# EAGLE design M-Enc-C (EAGLE 7.6.0)

## Sheet 1 of 2
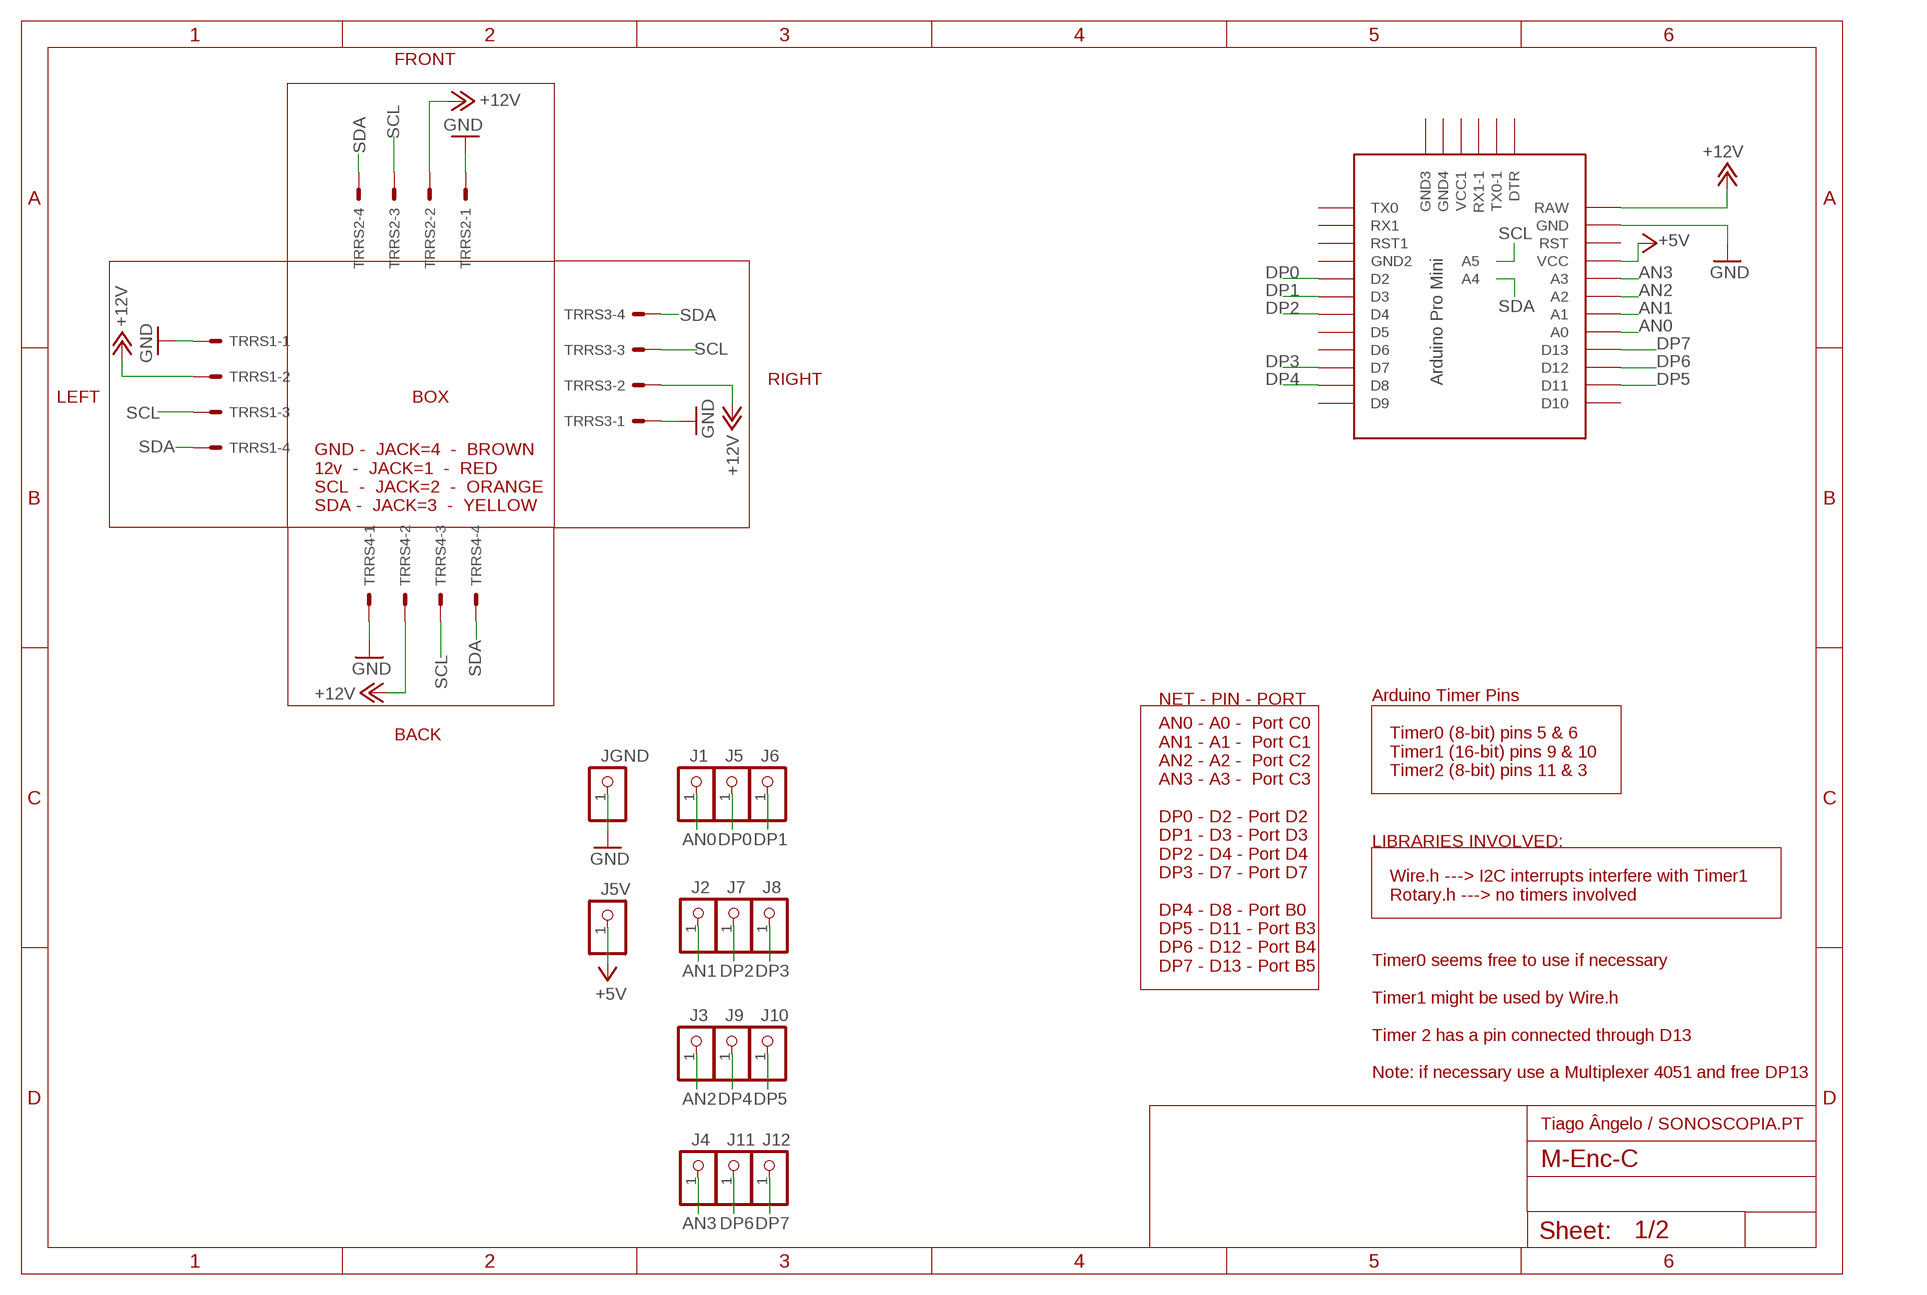
[diagram p0: schematic, sheet 1]

### Parts
J1  PINHD-1X1  [1X01]
J2  PINHD-1X1  [1X01]
J3  PINHD-1X1  [1X01]
J4  PINHD-1X1  [1X01]
J5  PINHD-1X1  [1X01]
J5V  PINHD-1X1  [1X01]
J6  PINHD-1X1  [1X01]
J7  PINHD-1X1  [1X01]
J8  PINHD-1X1  [1X01]
J9  PINHD-1X1  [1X01]
J10  PINHD-1X1  [1X01]
J11  PINHD-1X1  [1X01]
J12  PINHD-1X1  [1X01]
JGND  PINHD-1X1  [1X01]
TRRS1  22-27-2041-04  [6410-04]
TRRS2  22-27-2041-04  [6410-04]
TRRS3  22-27-2041-04  [6410-04]
TRRS4  22-27-2041-04  [6410-04]
U$1  PRO-MINI-2  [PRO-MINI-2]

### Nets
+5V: J5V.1 U$1.VCC
+12V: TRRS1.2 TRRS2.2 TRRS3.2 TRRS4.2 U$1.RAW
AN0: J1.1 U$1.A0
AN1: J2.1 U$1.A1
AN2: J3.1 U$1.A2
AN3: J4.1 U$1.A3
DP0: J5.1 U$1.D2
DP1: J6.1 U$1.D3
DP2: J7.1 U$1.D4
DP3: J8.1 U$1.D7
DP4: J9.1 U$1.D8
DP5: J10.1 U$1.D11
DP6: J11.1 U$1.D12
DP7: J12.1 U$1.D13
GND: JGND.1 TRRS1.1 TRRS2.1 TRRS3.1 TRRS4.1 U$1.GND
SCL: TRRS1.3 TRRS2.3 TRRS3.3 TRRS4.3 U$1.A5
SDA: TRRS1.4 TRRS2.4 TRRS3.4 TRRS4.4 U$1.A4
Unconnected: U$1.D5 U$1.D6 U$1.D9 U$1.D10 U$1.DTR U$1.GND1(GND2) U$1.GND2(GND3) U$1.GND3(GND4) U$1.RST U$1.RST1 U$1.RX1 U$1.RX1-1 U$1.TX0 U$1.TX0-1 U$1.VCC1

### Notes on the sheet
- FRONT
- RIGHT
- LEFT | BOX
- GND -  JACK=4  -  BROWN
  12v  -  JACK=1  -  RED
  SCL  -  JACK=2  -  ORANGE
  SDA -  JACK=3  -  YELLOW
- NET - PIN - PORT | Arduino Timer Pins
- BACK
- Timer0 (8-bit) pins 5 & 6
  Timer1 (16-bit) pins 9 & 10 
  Timer2 (8-bit) pins 11 & 3
- LIBRARIES INVOLVED:
- Wire.h ---> I2C interrupts interfere with Timer1
  Rotary.h ---> no timers involved
- AN0 - A0 -  Port C0
  AN1 - A1 -  Port C1
  AN2 - A2 -  Port C2
  AN3 - A3 -  Port C3 
  
  DP0 - D2 - Port D2
  DP1 - D3 - Port D3
  DP2 - D4 - Port D4
  DP3 - D7 - Port D7
  
  DP4 - D8 - Port B0
  DP5 - D11 - Port B3
  DP6 - D12 - Port B4
  DP7 - D13 - Port B5
- Timer0 seems free to use if necessary 
  
  Timer1 might be used by Wire.h
  
  Timer 2 has a pin connected through D13
  
  Note: if necessary use a Multiplexer 4051 and free DP13
- Tiago Ângelo / SONOSCOPIA.PT

## Sheet 2 of 2
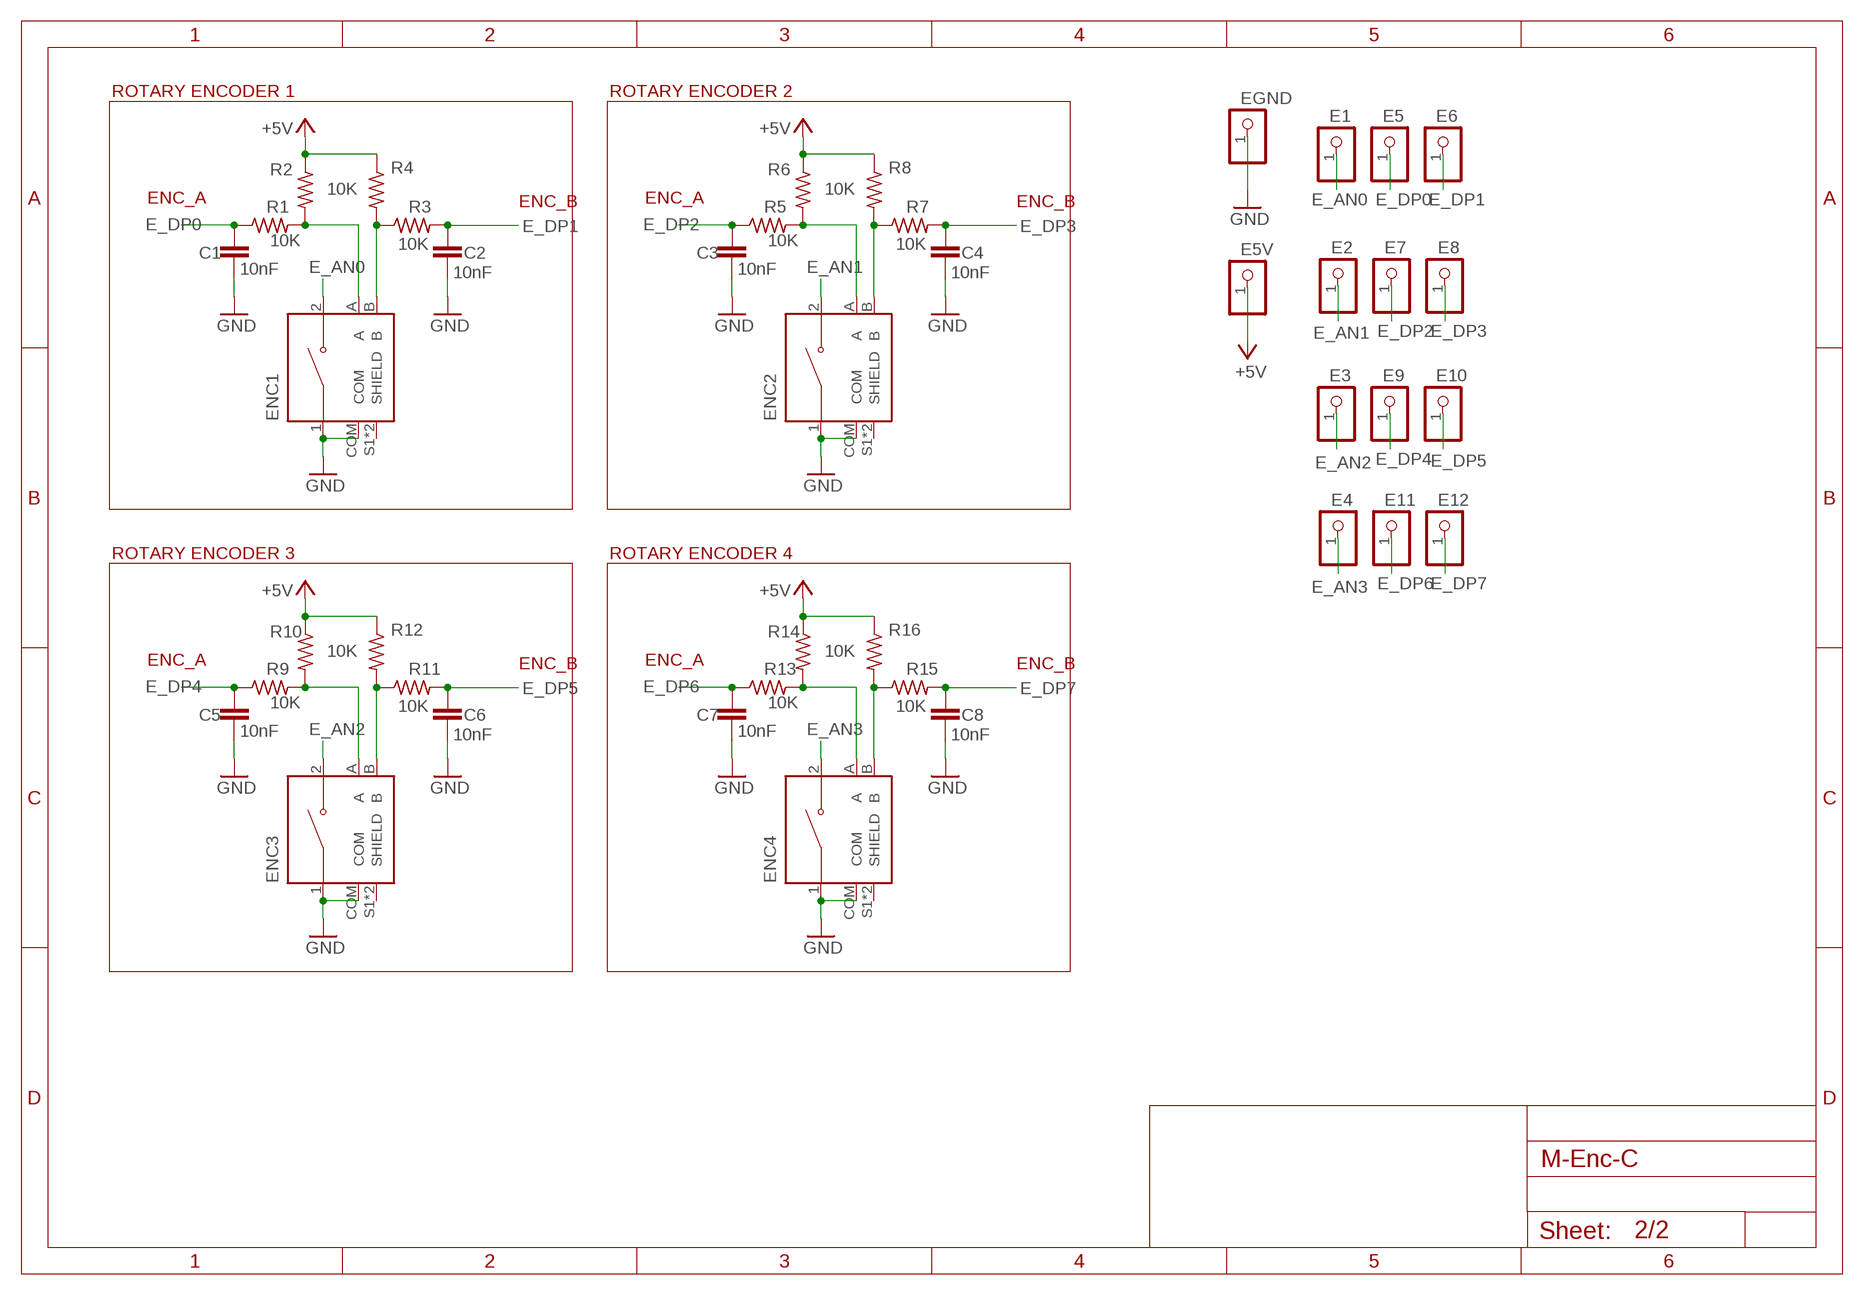
[diagram p1: schematic, sheet 2]

### Parts
C1  10nF  C5/2.5  [C5B2.5]
C2  10nF  C10/4  [C10B4]
C3  10nF  C5/2.5  [C5B2.5]
C4  10nF  C10/4  [C10B4]
C5  10nF  C10/4  [C10B4]
C6  10nF  C2.5/2  [C2.5-2]
C7  10nF  C10/4  [C10B4]
C8  10nF  C2.5/2  [C2.5-2]
E1  PINHD-1X1  [1X01]
E2  PINHD-1X1  [1X01]
E3  PINHD-1X1  [1X01]
E4  PINHD-1X1  [1X01]
E5  PINHD-1X1  [1X01]
E5V  PINHD-1X1  [1X01]
E6  PINHD-1X1  [1X01]
E7  PINHD-1X1  [1X01]
E8  PINHD-1X1  [1X01]
E9  PINHD-1X1  [1X01]
E10  PINHD-1X1  [1X01]
E11  PINHD-1X1  [1X01]
E12  PINHD-1X1  [1X01]
EGND  PINHD-1X1  [1X01]
ENC1  PEC11R-4215F-S0024  [XDCR_PEC11R-4215F-S0024]
ENC2  PEC11R-4215F-S0024  [XDCR_PEC11R-4215F-S0024]
ENC3  PEC11R-4215F-S0024  [XDCR_PEC11R-4215F-S0024]
ENC4  PEC11R-4215F-S0024  [XDCR_PEC11R-4215F-S0024]
R1  10K  R-US_0204/7  [0204/7]
R2  10K  R-US_0204/7  [0204/7]
R3  10K  R-US_0204/7  [0204/7]
R4  10K  R-US_0207/12  [0207/12]
R5  10K  R-US_0204/7  [0204/7]
R6  10K  R-US_0204/7  [0204/7]
R7  10K  R-US_0204/7  [0204/7]
R8  10K  R-US_0207/12  [0207/12]
R9  10K  R-US_0204/7  [0204/7]
R10  10K  R-US_0207/12  [0207/12]
R11  10K  R-US_0204/7  [0204/7]
R12  10K  R-US_0204/7  [0204/7]
R13  10K  R-US_0204/7  [0204/7]
R14  10K  R-US_0207/12  [0207/12]
R15  10K  R-US_0204/7  [0204/7]
R16  10K  R-US_0204/7  [0204/7]

### Nets
E_+5V: E5V.1 R2.1 R4.1 R6.1 R8.1 R10.1 R12.1 R14.1 R16.1 ; supply symbol labelled +5V
E_AN0: E1.1 ENC1.2
E_AN1: E2.1 ENC2.2
E_AN2: E3.1 ENC3.2
E_AN3: E4.1 ENC4.2
E_DP0: C1.1 E5.1 R1.1
E_DP1: C2.1 E6.1 R3.2
E_DP2: C3.1 E7.1 R5.1
E_DP3: C4.1 E8.1 R7.2
E_DP4: C5.1 E9.1 R9.1
E_DP5: C6.1 E10.1 R11.2
E_DP6: C7.1 E11.1 R13.1
E_DP7: C8.1 E12.1 R15.2
E_GND: C1.2 C2.2 C3.2 C4.2 C5.2 C6.2 C7.2 C8.2 EGND.1 ENC1.1 ENC1.COM ENC2.1 ENC2.COM ENC3.1 ENC3.COM ENC4.1 ENC4.COM ; supply symbol labelled GND
N$1: ENC2.A R5.2 R6.2
N$2: ENC1.B R3.1 R4.2
N$3: ENC2.B R7.1 R8.2
N$4: ENC3.A R9.2 R10.2
N$5: ENC3.B R11.1 R12.2
N$6: ENC4.A R13.2 R14.2
N$7: ENC4.B R15.1 R16.2
N$9: ENC1.A R1.2 R2.2
Unconnected: ENC1.S1(SHIELD) ENC1.S2(SHIELD) ENC2.S1(SHIELD) ENC2.S2(SHIELD) ENC3.S1(SHIELD) ENC3.S2(SHIELD) ENC4.S1(SHIELD) ENC4.S2(SHIELD)

### Notes on the sheet
- ROTARY ENCODER 1 | ROTARY ENCODER 2
- ENC_A | ENC_B | ENC_A | ENC_B
- ROTARY ENCODER 3 | ROTARY ENCODER 4
- ENC_A | ENC_B | ENC_A | ENC_B

## Library data of the parts
C1-C8 = capacitor-wima:C: CAPACITOR naming: grid - package width
E1-E5 E5V E6-E12 EGND J1-J5 J5V J6-J12 JGND = adafruit:PINHD-1X1: Pin header 1x1 for 0.1" spacing With round pins
ENC1-ENC4 = PEC11R-4215F-S0024:PEC11R-4215F-S0024: Incremental Encoder, 12 Mm, Contact Rating 10 Ma - 5 Vdc Check prices <https://pricing.snapeda.com/parts/PEC11R-4215F-S0024/Bourns/view-part?ref=eda>; AVAILABILITY: Warning; DESCRIPTION: Rotary Encoder Mechanical 24 Quadrature (Incremental) Vertical; MF: Bourns; MP: PEC11R-4215F-S0024; PACKAGE: None; PRICE: None; PURCHASE-URL: https://pricing.snapeda.com/search/part/PEC11R-4215F-S0024/?ref=eda
R1-R16 = resistor:R-US_: RESISTOR, American symbol
TRRS1-TRRS4 = _M-BLOCKS:22-?-04: CONNECTOR wire to board 2.54 mm (.1 inch) pitch header
U$1 = _M-BLOCKS:PRO-MINI-2: Arduino Pro Mini Layout 2 Sparkfun.com

## Board
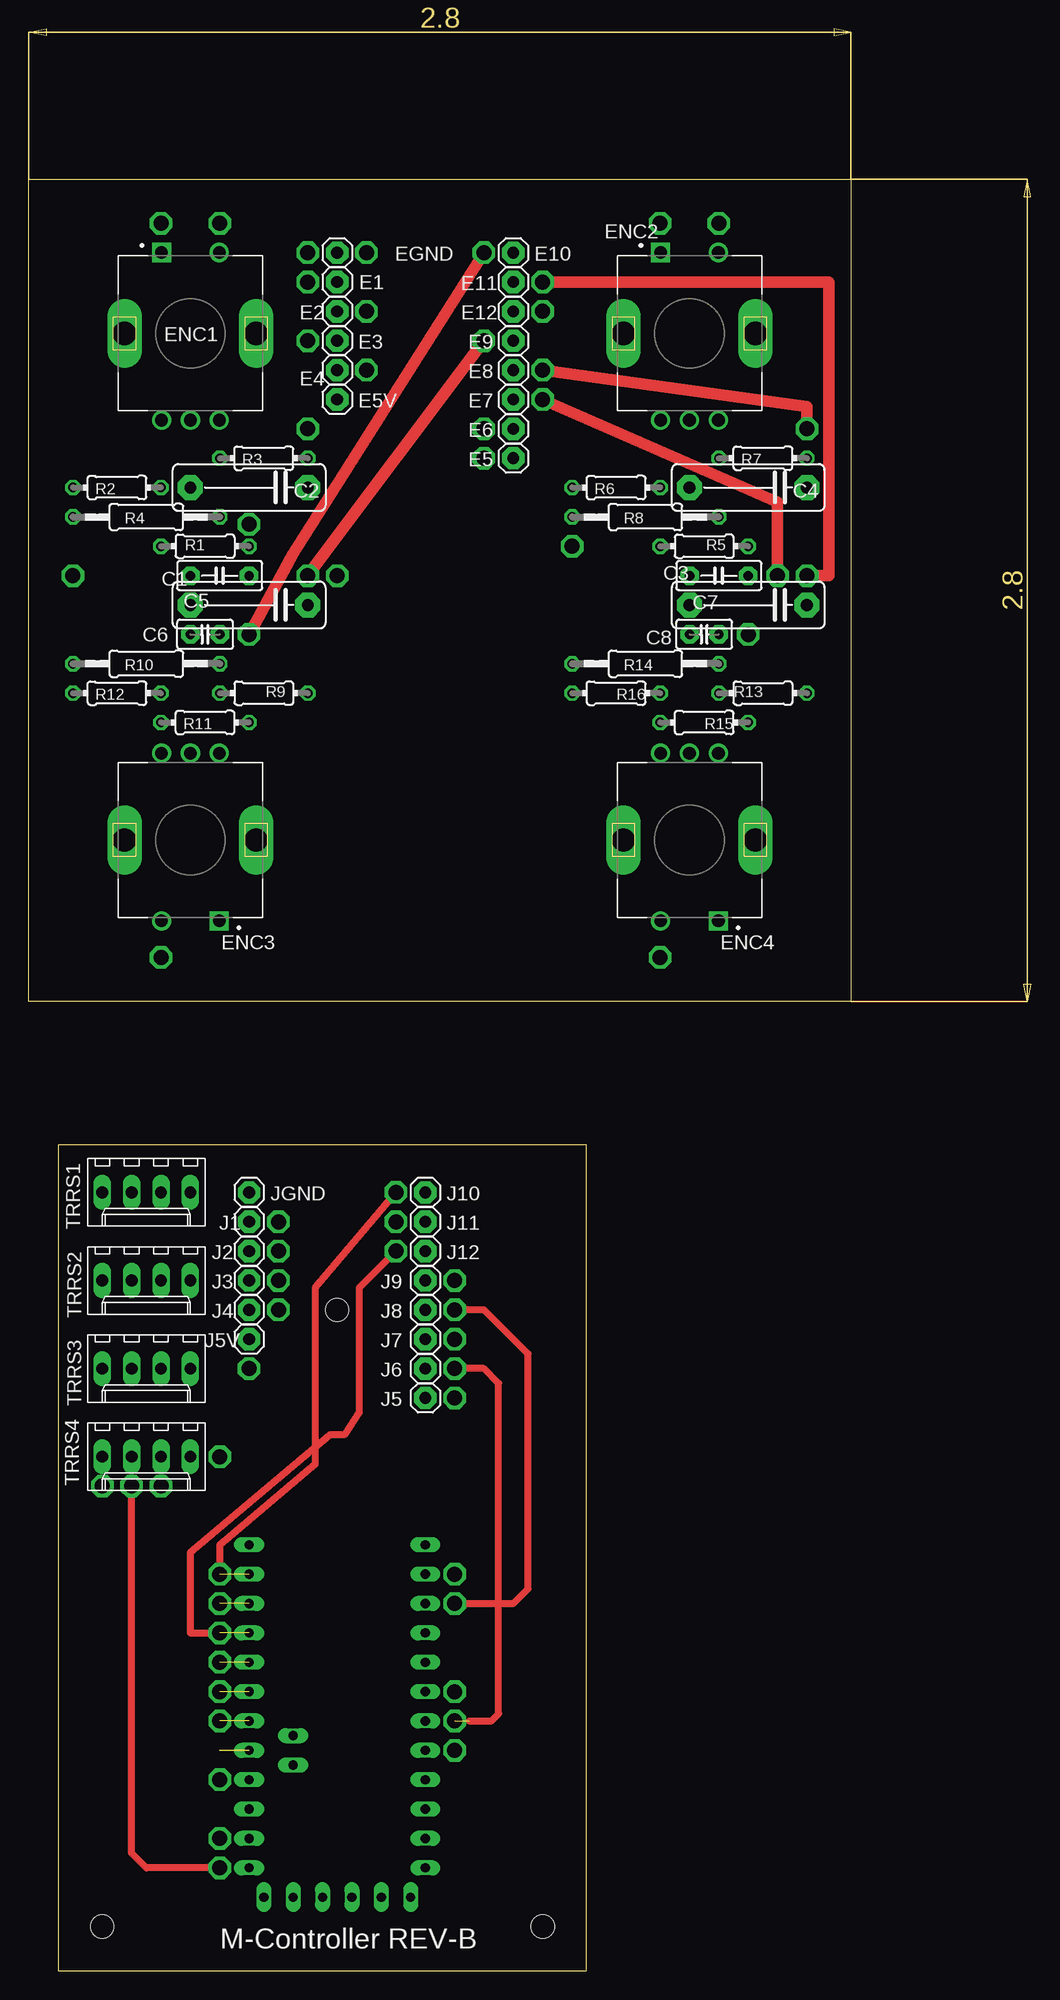
[diagram p2: board, top side]
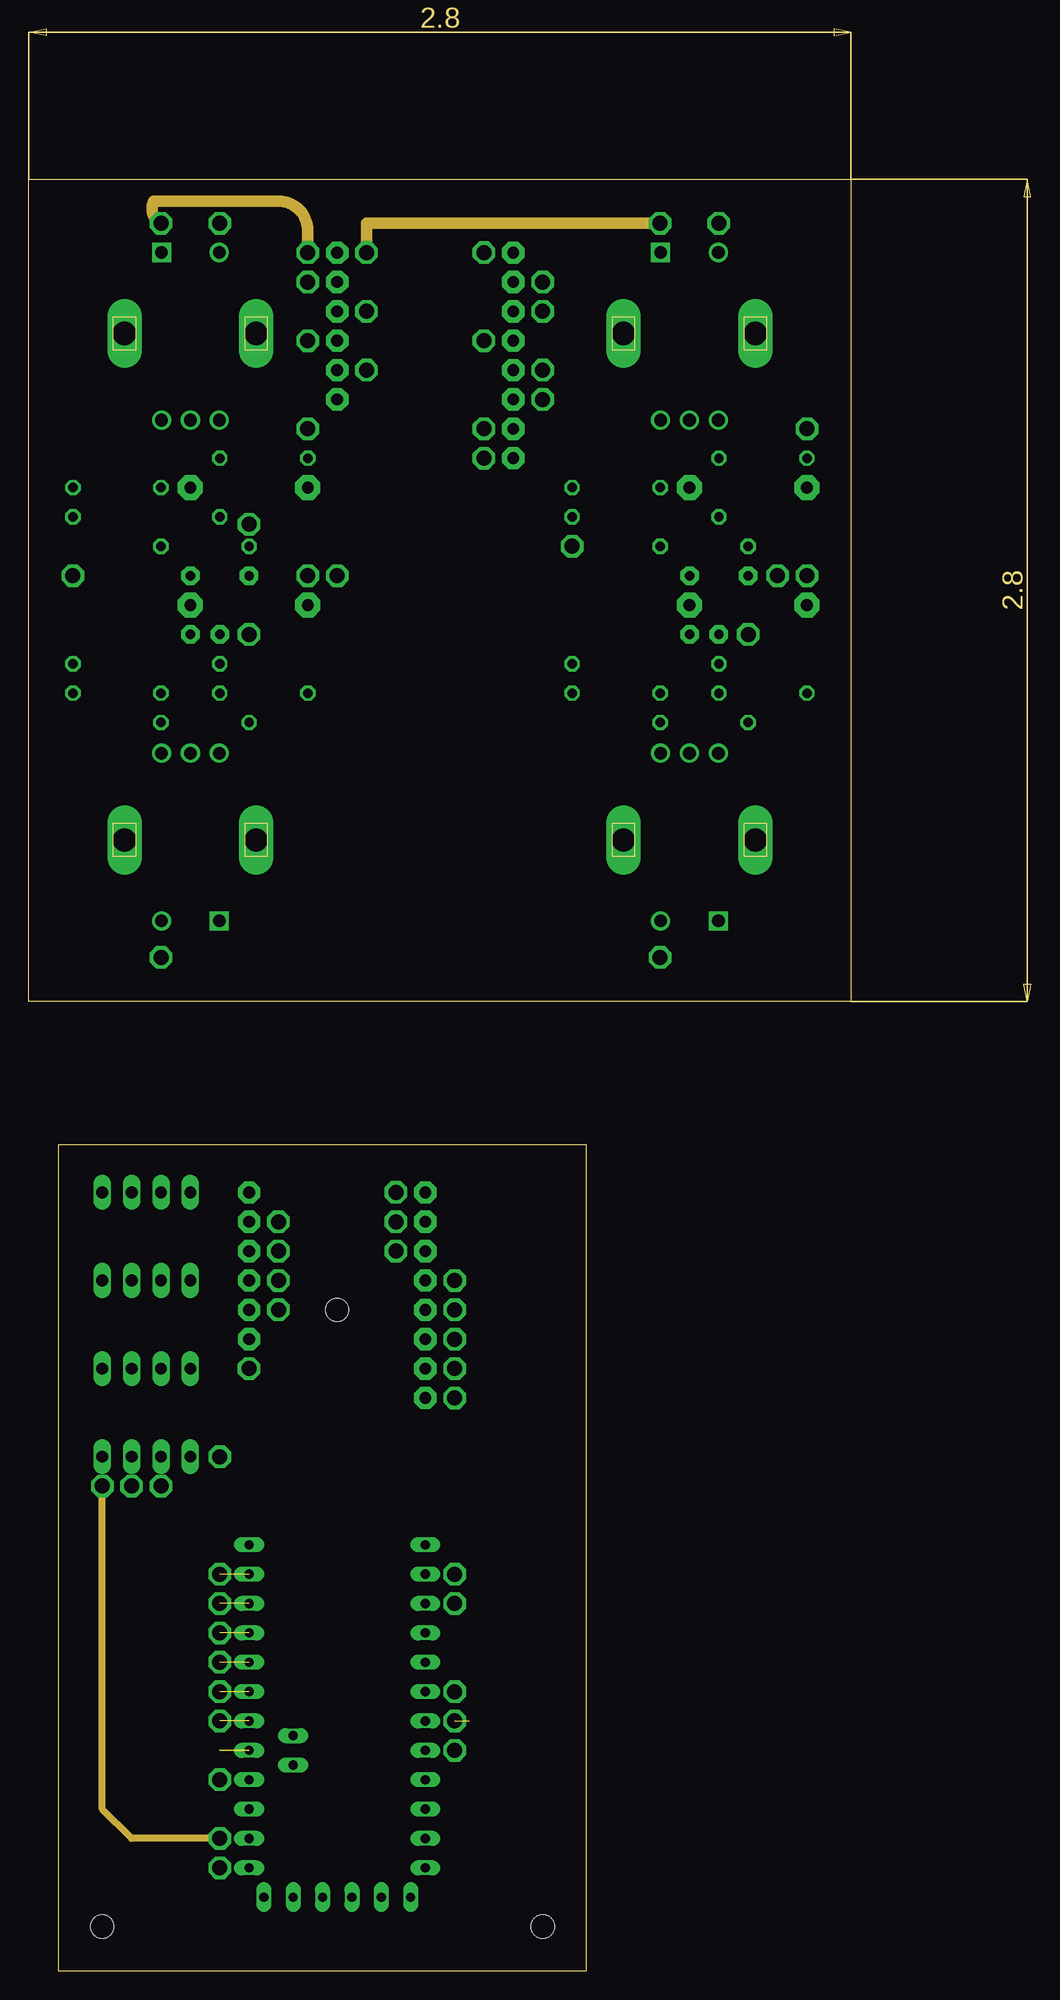
[diagram p3: board, inner layer Ground]
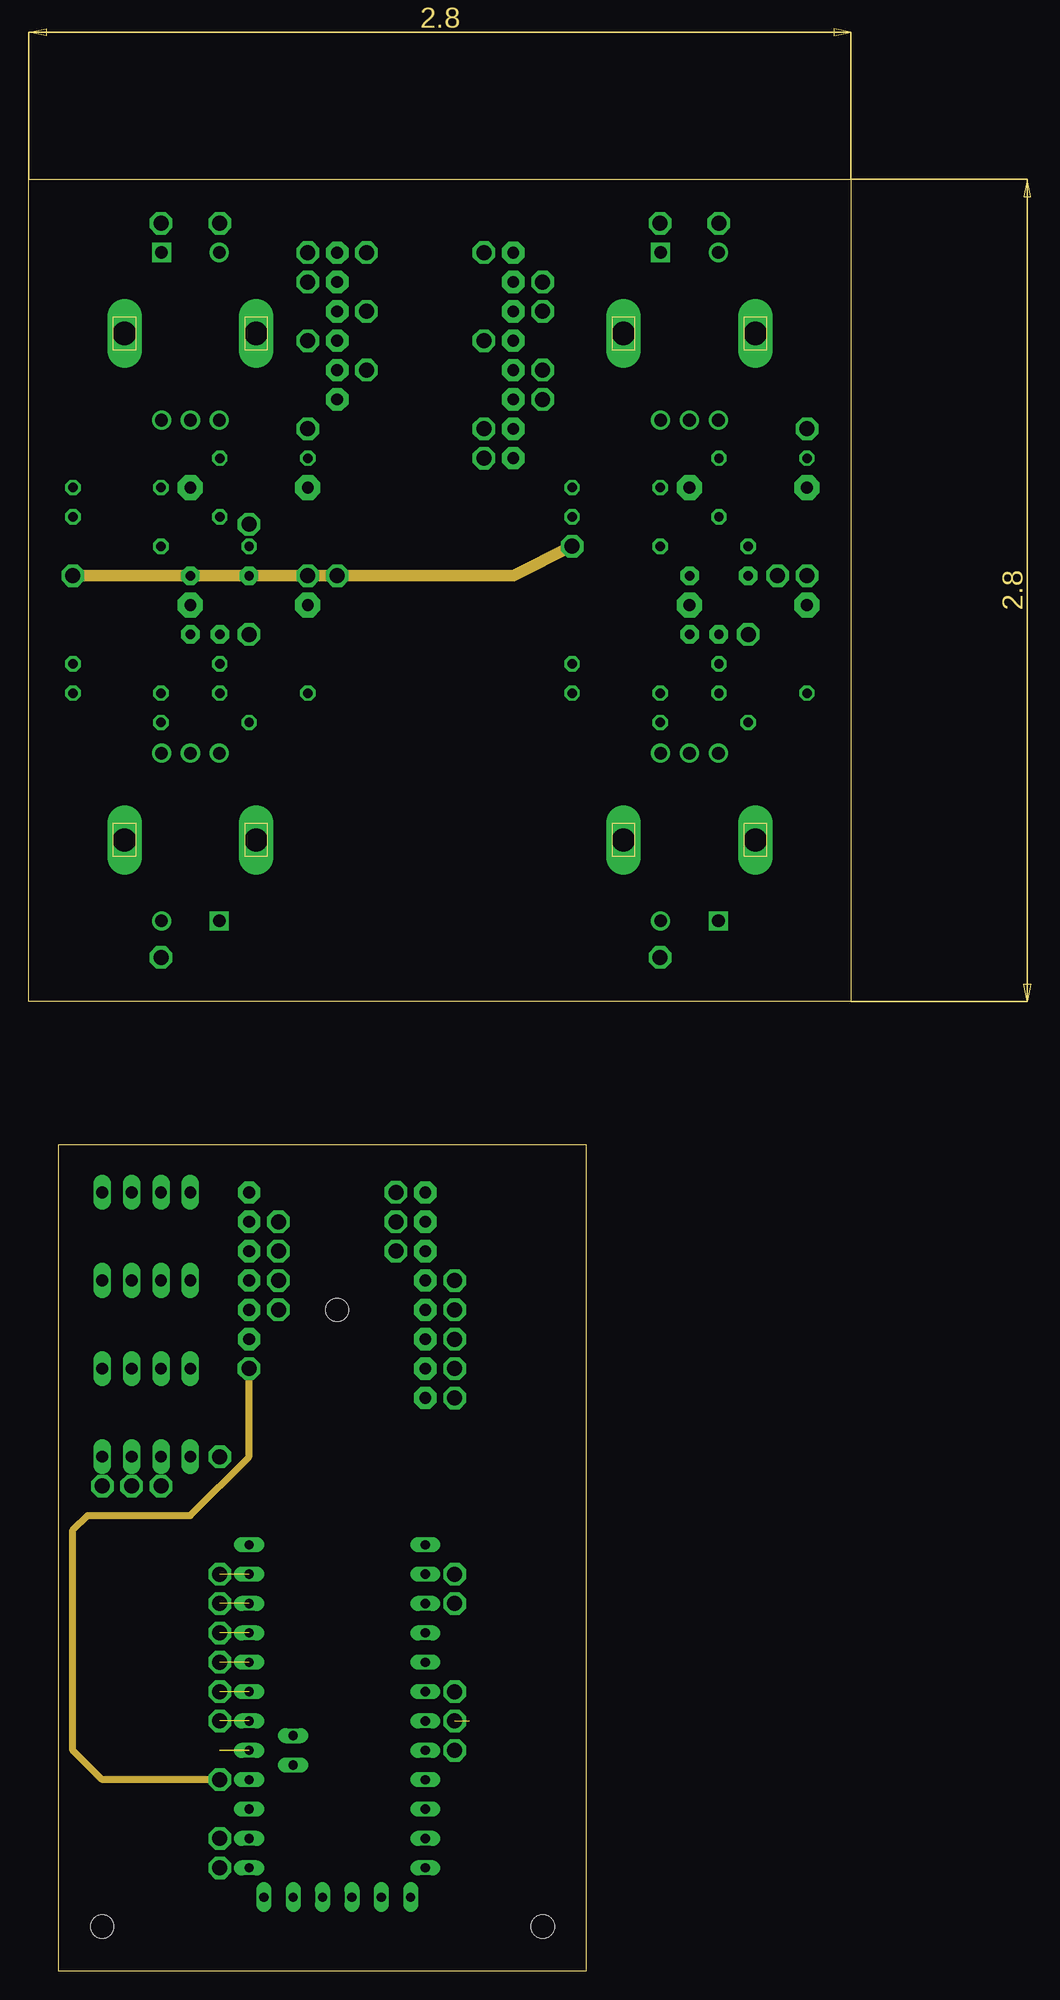
[diagram p4: board, inner layer +5Volts]
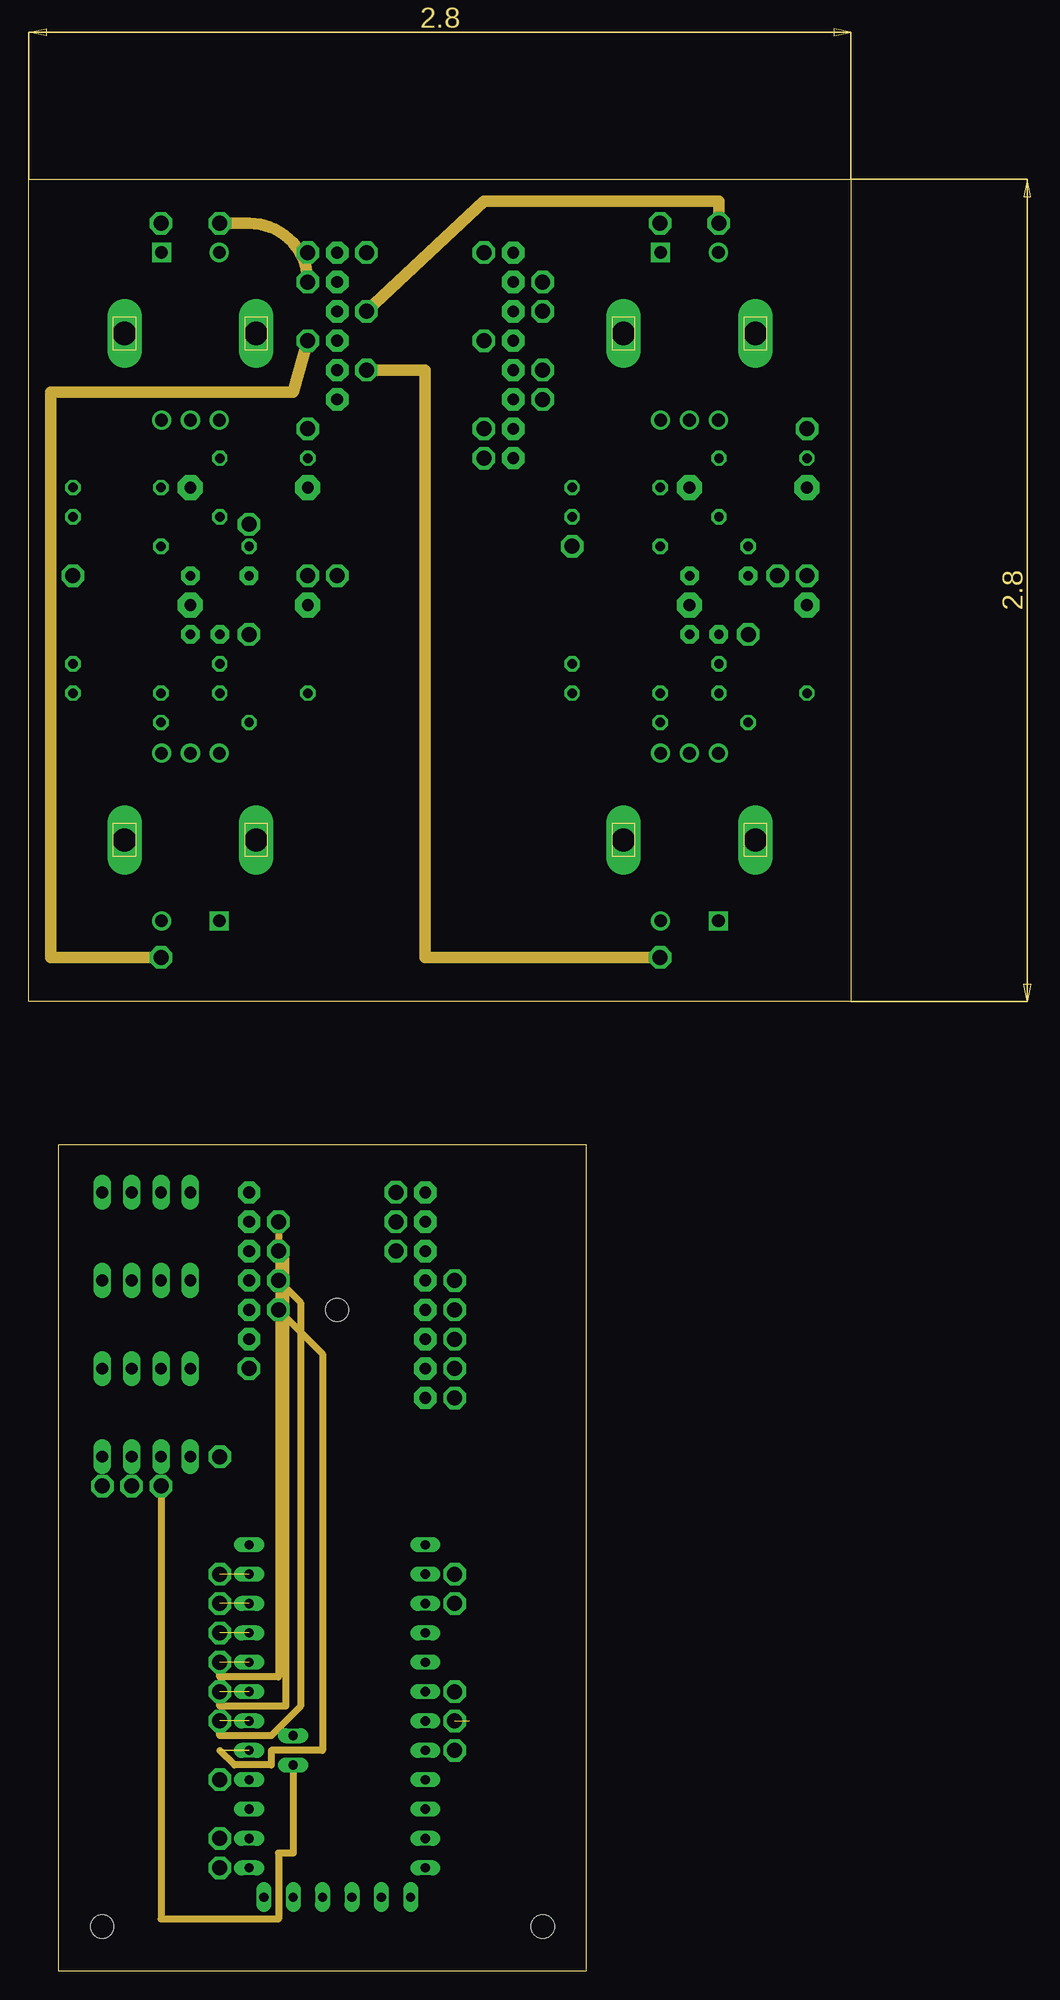
[diagram p5: board, inner layer AnalogPins]
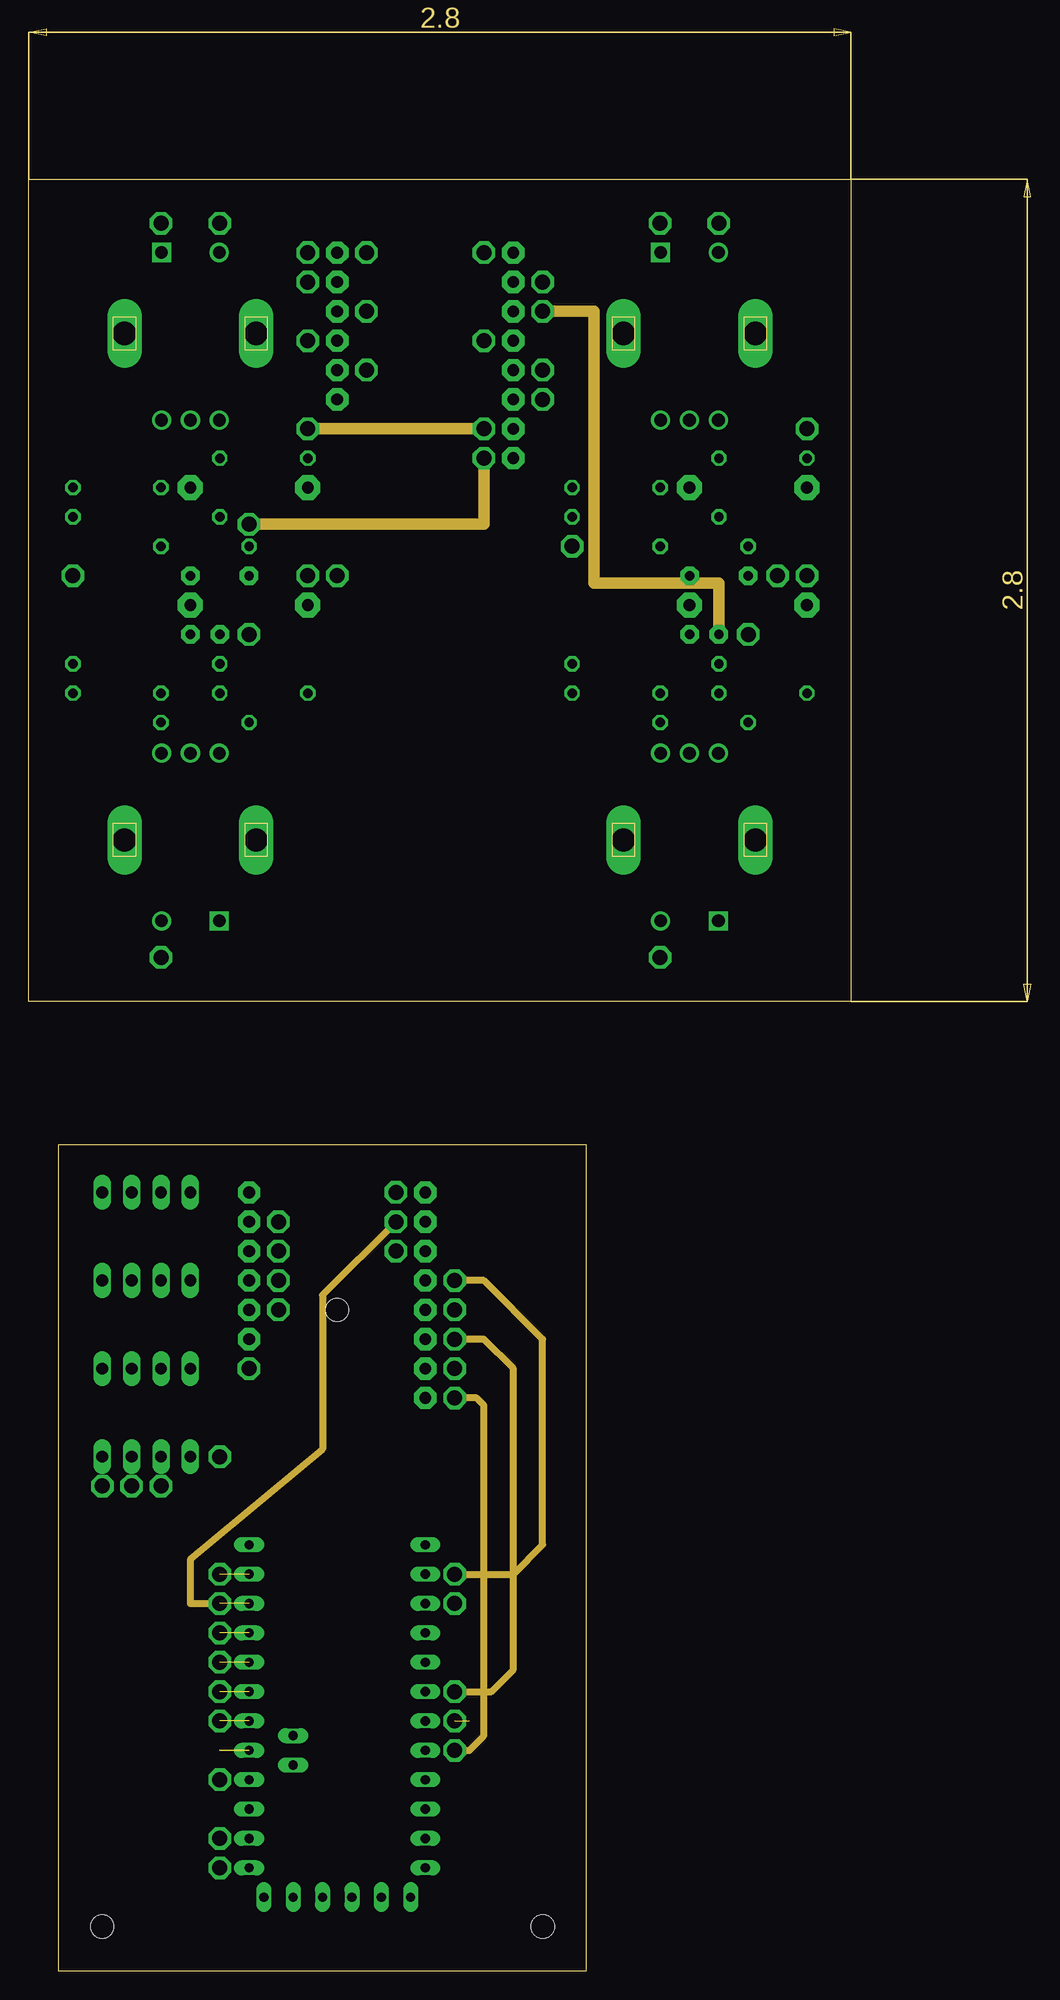
[diagram p6: board, inner layer DigitalPins_2]
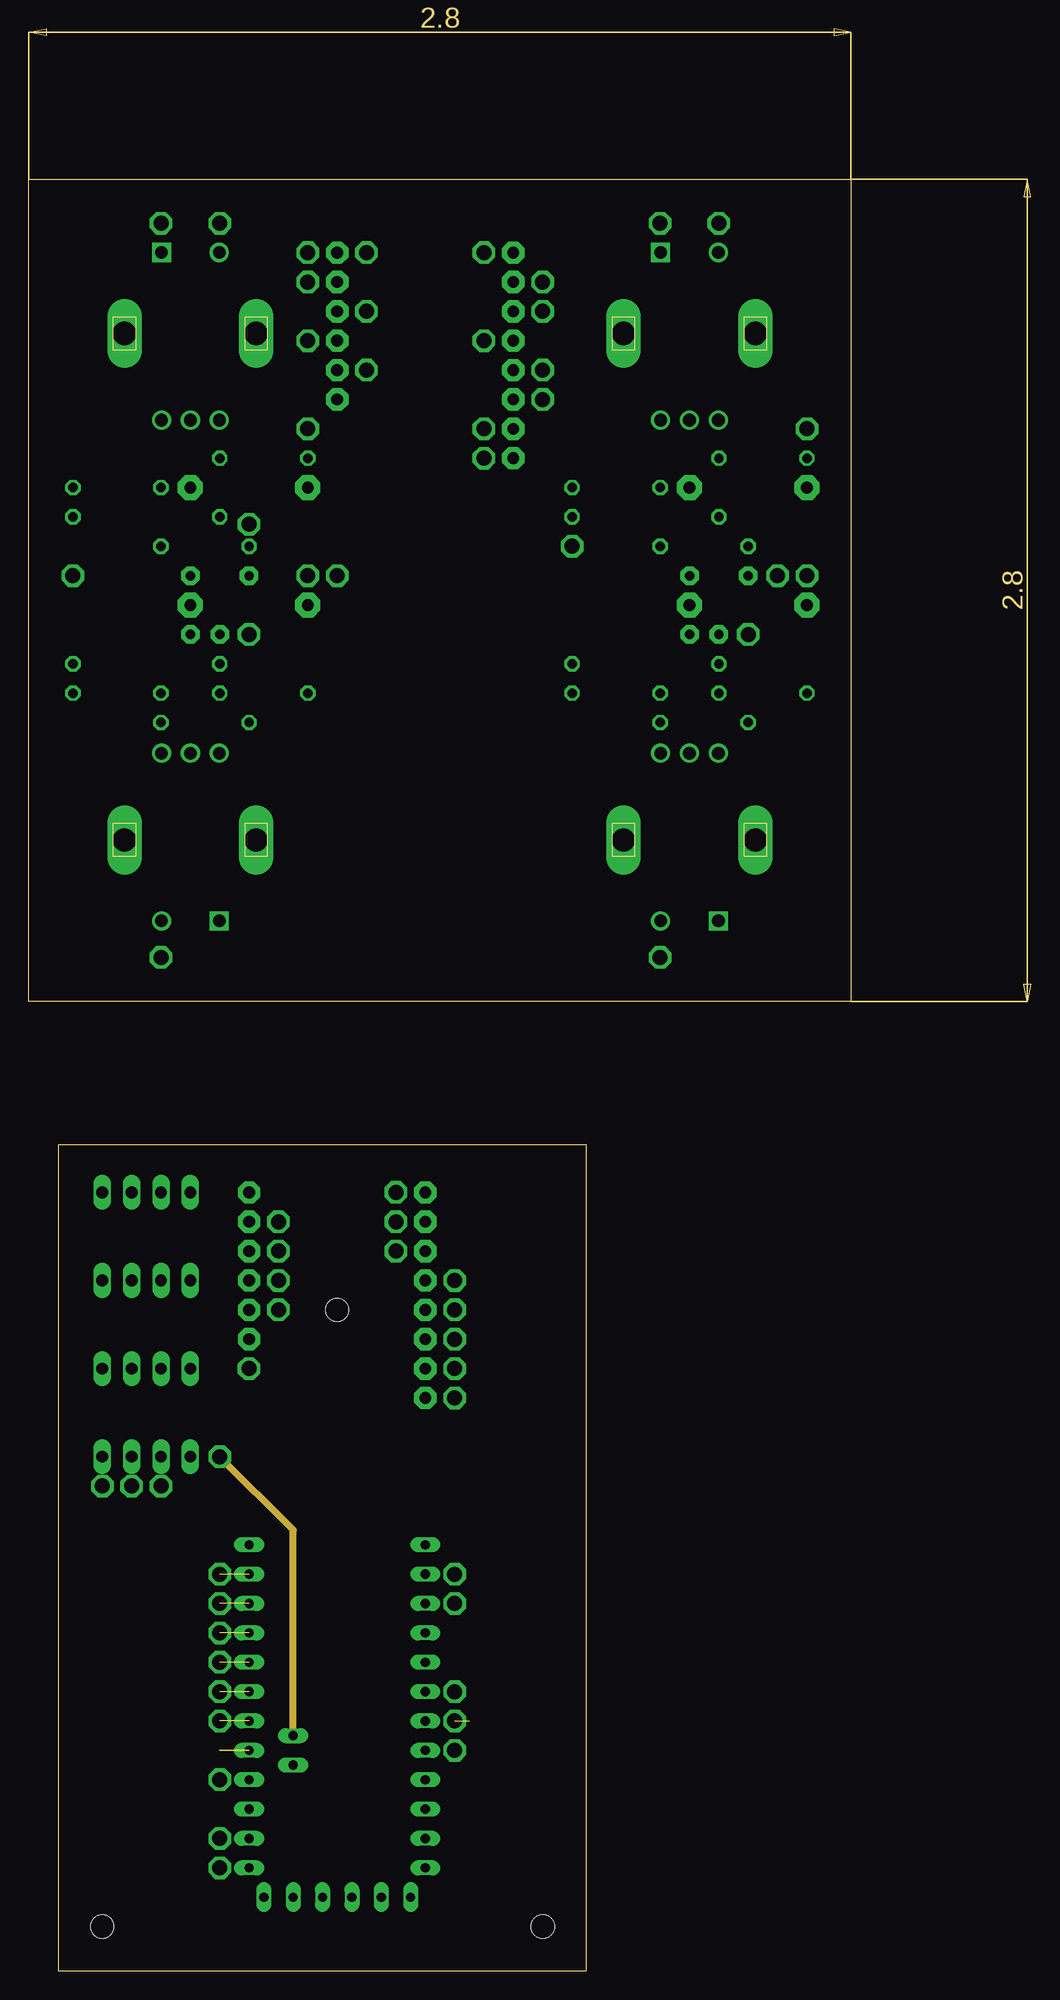
[diagram p7: board, inner layer SDA_cable]
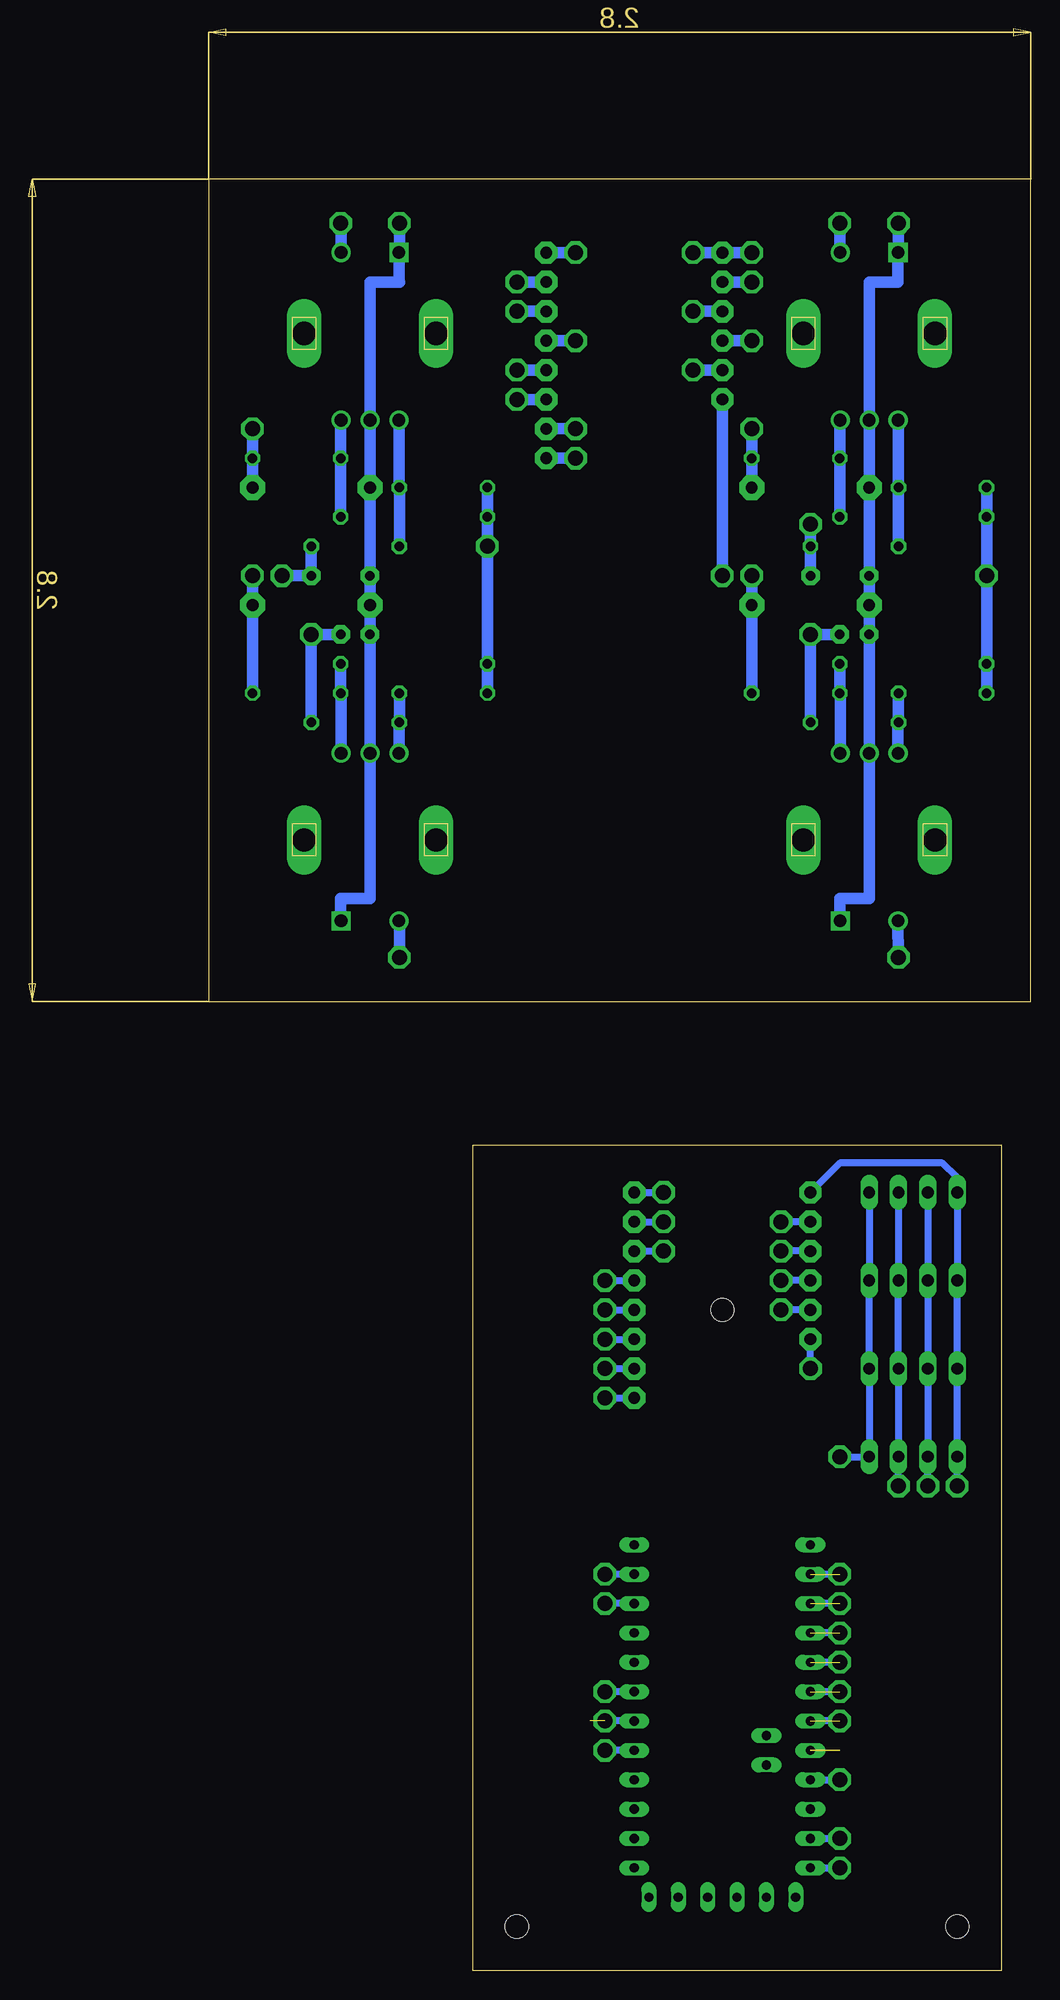
[diagram p8: board, bottom side, seen from below]

Size 71.12 x 154.94 mm. Coordinates in mm from the lower left corner, seen from the top.
Outline: 2.54,0 48.24,0 48.24,71.42 2.54,71.42 2.54,0
Outline: 0,154.94 71.12,154.94 71.12,83.82 0,83.82 0,154.94
Copper layers (1*2*3*4*5*6*16): DigitalPins_1 0.035mm / dielectric 1.5mm / Ground 0.035mm / dielectric 0.15mm / +5Volts 0.035mm / dielectric 0.2mm / AnalogPins 0.035mm / dielectric 0.15mm / DigitalPins_2 0.035mm / dielectric 0.2mm / SDA_cable 0.035mm / dielectric 0.15mm / Bottom 0.035mm
Design rules "default *": minimum track width 10mil, minimum drill 24mil, track to track 8mil, track to pad 8mil, pad to pad 8mil, via to via 8mil, smd to smd 8mil, copper to edge 40mil, drill to drill 8mil, minimum pad ring 10mil, minimum via ring 8mil, stop-mask expansion 4mil, vias tented up to drill 0mil, thermal gap 10mil
Holes 2 mm at 6.35,3.81 26.67,57.15 44.45,3.81

### Footprints (pad centres in the part's own frame; a part is rotated, then mirrored left to right if it is on the bottom)
C5B2.5 = drill 0.813 pad 1.6 octagon: 1 -2.54,0; 2 2.54,0
C10B4 = drill 1.016 pad 2.159 octagon: 1 -5.08,0; 2 5.08,0
C2.5-2 = drill 0.813 pad 1.6 octagon: 1 -1.27,0; 2 1.27,0
1X01 = drill 1.016 pad 1.93 octagon: 1 0,0
XDCR_PEC11R-4215F-S0024 = drill 1.1 square: 1 -2.5,7 | drill 1.1: 2 2.5,7; A -2.5,-7.5; B 2.5,-7.5; COM 0,-7.5 | drill 2 long: S1 -5.7,0; S2 5.7,0
0204/7 = drill 0.813 octagon: 1 -3.81,0; 2 3.81,0
0207/12 = drill 0.813 octagon: 1 -6.35,0; 2 6.35,0
6410-04 = drill 1.016 long: 1 3.81,0; 2 1.27,0; 3 -1.27,0; 4 -3.81,0
PRO-MINI-2 = drill 0.8 long: A0 6.35,-5.08; A1 6.35,-2.54; A2 6.35,0; A3 6.35,2.54; A4 2.54,1.27; A5 2.54,3.81; D2 -8.89,2.54; D3 -8.89,0; D4 -8.89,-2.54; D5 -8.89,-5.08; D6 -8.89,-7.62; D7 -8.89,-10.16; D8 -8.89,-12.7; D9 -8.89,-15.24; D10 6.35,-15.24; D11 6.35,-12.7; D12 6.35,-10.16; D13 6.35,-7.62; DTR 5.08,15.24; GND 6.35,10.16; GND1 -8.89,5.08; GND2 -7.62,15.24; GND3 -5.08,15.24; RAW 6.35,12.7; RST 6.35,7.62; RST1 -8.89,7.62; RX1 -8.89,10.16; RX1-1 0,15.24; TX0 -8.89,12.7; TX0-1 2.54,15.24; VCC 6.35,5.08; VCC1 -2.54,15.24

### Placement (x,y rotation side)
C1  16.51,120.65 180 top
C2  19.05,128.27 180 top
C3  59.69,120.65 180 top
C4  62.23,128.27 180 top
C5  19.05,118.11 180 top
C6  15.24,115.57 180 top
C7  62.23,118.11 180 top
C8  58.42,115.57 180 top
E1  26.67,146.05 0 top
E2  26.67,143.51 0 top
E3  26.67,140.97 0 top
E4  26.67,138.43 0 top
E5  41.91,130.81 0 top
E5V  26.67,135.89 0 top
E6  41.91,133.35 0 top
E7  41.91,135.89 0 top
E8  41.91,138.43 0 top
E9  41.91,140.97 0 top
E10  41.91,148.59 0 top
E11  41.91,146.05 0 top
E12  41.91,143.51 0 top
EGND  26.67,148.59 0 top
ENC1  13.97,141.6 0 top
ENC2  57.15,141.6 0 top
ENC3  13.97,97.79 180 top
ENC4  57.15,97.79 180 top
J1  19.05,64.77 0 top
J2  19.05,62.23 0 top
J3  19.05,59.69 0 top
J4  19.05,57.15 0 top
J5  34.29,49.53 0 top
J5V  19.05,54.61 0 top
J6  34.29,52.07 0 top
J7  34.29,54.61 0 top
J8  34.29,57.15 0 top
J9  34.29,59.69 0 top
J10  34.29,67.31 0 top
J11  34.29,64.77 0 top
J12  34.29,62.23 0 top
JGND  19.05,67.31 0 top
R1  15.24,123.19 180 top
R2  7.62,128.27 0 top
R3  20.32,130.81 0 top
R4  10.16,125.73 0 top
R5  58.42,123.19 180 top
R6  50.8,128.27 0 top
R7  63.5,130.81 0 top
R8  53.34,125.73 0 top
R9  20.32,110.49 180 top
R10  10.16,113.03 0 top
R11  15.24,107.95 0 top
R12  7.62,110.49 0 top
R13  63.5,110.49 180 top
R14  53.34,113.03 0 top
R15  58.42,107.95 0 top
R16  50.8,110.49 0 top
TRRS1  10.16,67.31 180 top
TRRS2  10.16,59.69 180 top
TRRS3  10.16,52.07 180 top
TRRS4  10.16,44.45 180 top
U$1  25.4,21.59 180 top

### Tracks (layer width: path | path; a pad name or v marks a point on that pad's centre or on a via)
+5V  (via drill 1.3 pad 1.27)
  +5Volts 0.61: v16.51,16.51 6.35,16.51 3.81,19.05 3.81,38.1 5.08,39.37 13.97,39.37 19.05,44.45 v19.05,52.07
  Bottom 0.61: U$1.VCC v16.51,16.51 | v19.05,52.07 J5V.1
+12V  (via drill 1.3 pad 1.27)
  DigitalPins_1 0.61: v16.51,8.89 10.16,8.89 8.89,10.16 v8.89,41.91
  Bottom 0.61: TRRS1.2 TRRS2.2 TRRS3.2 TRRS4.2 v8.89,41.91 | U$1.RAW v16.51,8.89
AN0  (via drill 1.3 pad 1.27)  (1 unrouted)
  AnalogPins 0.61: v21.59,64.77 21.59,25.4 16.51,25.4 v16.51,26.67
  Bottom 0.61: J1.1 v21.59,64.77 | v16.51,26.67 U$1.A0
AN1  (via drill 1.3 pad 1.27)  (1 unrouted)
  AnalogPins 0.61: v21.59,62.23 22.22,61.59 22.22,22.86 16.51,22.86 v16.51,24.13
  Bottom 0.61: J2.1 v21.59,62.23 | v16.51,24.13 U$1.A1
AN2  (via drill 1.3 pad 1.27)  (1 unrouted)
  AnalogPins 0.61: v21.59,59.69 23.49,57.78 23.49,22.86 20.95,20.32 16.51,20.32 v16.51,21.59
  Bottom 0.61: J3.1 v21.59,59.69 | v16.51,21.59 U$1.A2
AN3  (via drill 1.3 pad 1.27)  (2 unrouted)
  AnalogPins 0.61: v21.59,57.15 25.4,53.34 25.4,19.05 20.95,19.05 20.95,17.78 17.78,17.78 16.51,19.05
  Bottom 0.61: J4.1 v21.59,57.15
DP0  (via drill 1.3 pad 1.27)
  DigitalPins_2 0.61: v36.83,19.05 38.1,19.05 39.37,20.32 39.37,48.9 38.73,49.53 v36.83,49.53
  Bottom 0.61: U$1.D2 v36.83,19.05 | v36.83,49.53 J5.1
DP1  (via drill 1.3 pad 1.27)  (1 unrouted)
  DigitalPins_1 0.61: 38.1,21.59 40.01,21.59 40.64,22.23 40.64,50.8 39.37,52.07 v36.83,52.07
  Bottom 0.61: U$1.D3 v36.83,21.59 | v36.83,52.07 J6.1
DP2  (via drill 1.3 pad 1.27)
  DigitalPins_2 0.61: v36.83,24.13 40.01,24.13 41.91,26.04 41.91,52.07 39.37,54.61 v36.83,54.61
  Bottom 0.61: U$1.D4 v36.83,24.13 | v36.83,54.61 J7.1
DP3  (via drill 1.3 pad 1.27)
  DigitalPins_1 0.61: v36.83,31.75 41.91,31.75 43.18,33.02 43.18,53.34 39.37,57.15 v36.83,57.15
  Bottom 0.61: U$1.D7 v36.83,31.75 | v36.83,57.15 J8.1
DP4  (via drill 1.3 pad 1.27)
  DigitalPins_2 0.61: v36.83,34.29 41.91,34.29 44.45,36.83 44.45,54.61 39.37,59.69 v36.83,59.69
  Bottom 0.61: U$1.D8 v36.83,34.29 | v36.83,59.69 J9.1
DP5  (via drill 1.3 pad 1.27)  (1 unrouted)
  DigitalPins_1 0.61: v31.75,67.31 24.77,59.05 24.77,43.81 16.51,36.83 v16.51,34.29
  Bottom 0.61: J10.1 v31.75,67.31 | v16.51,34.29 U$1.D11
DP6  (via drill 1.3 pad 1.27)  (1 unrouted)
  DigitalPins_2 0.61: v31.75,64.77 25.4,58.42 25.4,45.09 13.97,35.56 13.97,31.75 v16.51,31.75
  Bottom 0.61: J11.1 v31.75,64.77 | v16.51,31.75 U$1.D12
DP7  (via drill 1.3 pad 1.27)  (1 unrouted)
  DigitalPins_1 0.61: v31.75,62.23 28.57,59.05 28.57,48.26 27.3,46.35 26.04,46.35 13.97,36.2 13.97,29.21 v16.51,29.21
  Bottom 0.61: J12.1 v31.75,62.23 | v16.51,29.21 U$1.D13
E_+5V  (via drill 1.3 pad 1.27)
  +5Volts 1.016: v46.99,123.19 41.91,120.65 v26.67,120.65 v3.81,120.65
  Bottom 1.016: R2.1 R4.1 v3.81,120.65 R10.1 R12.1 | R6.1 R8.1 v46.99,123.19 R14.1 R16.1 | E5V.1 v26.67,120.65
E_AN0  (via drill 1.3 pad 1.27)
  AnalogPins 1.016: v16.51,151.13 19.05,151.13 arc-90 v24.13,146.05
  Bottom 1.016: ENC1.2 16.51,148.6 v16.51,151.13 | v24.13,146.05 E1.1
E_AN1  (via drill 1.3 pad 1.27)
  AnalogPins 1.016: v29.21,143.51 39.37,153.03 59.69,153.03 v59.69,151.13
  Bottom 1.016: E2.1 v29.21,143.51 | v59.69,151.13 59.65,151.09 ENC2.2
E_AN2  (via drill 1.3 pad 1.27)
  AnalogPins 1.016: v24.13,140.97 22.86,136.53 1.91,136.53 1.91,87.63 v11.43,87.63
  Bottom 1.016: ENC3.2 v11.43,87.63 | E3.1 v24.13,140.97
E_AN3  (via drill 1.3 pad 1.27)
  AnalogPins 1.016: v54.61,87.63 34.29,87.63 34.29,138.43 v29.21,138.43
  Bottom 1.016: ENC4.2 54.61,90.79 v54.61,87.63 | v29.21,138.43 E4.1
E_DP0  (via drill 1.3 pad 1.27)
  DigitalPins_2 1.016: v19.05,125.09 39.37,125.09 v39.37,130.81
  Bottom 1.016: C1.1 R1.1 v19.05,125.09 | v39.37,130.81 E5.1
E_DP1  (via drill 1.3 pad 1.27)
  DigitalPins_2 1.016: v24.13,133.35 v39.37,133.35
  Bottom 1.016: C2.1 R3.2 v24.13,133.35 | v39.37,133.35 E6.1
E_DP2  (via drill 1.3 pad 1.27)
  DigitalPins_1 1.016: v44.45,135.89 64.77,127 v64.77,120.65
  Bottom 1.016: R5.1 C3.1 v64.77,120.65 | E7.1 v44.45,135.89
E_DP3  (via drill 1.3 pad 1.27)
  DigitalPins_1 1.016: v44.45,138.43 67.31,135.25 v67.31,133.35
  Bottom 1.016: C4.1 R7.2 v67.31,133.35 | E8.1 v44.45,138.43
E_DP4  (via drill 1.3 pad 1.27)
  DigitalPins_1 1.016: v24.13,120.65 v39.37,140.97
  Bottom 1.016: R9.1 C5.1 v24.13,120.65 | v39.37,140.97 E9.1
E_DP5  (via drill 1.3 pad 1.27)
  DigitalPins_1 1.016: v19.05,115.57 22.86,122.56 v39.37,148.59
  Bottom 1.016: C6.1 v19.05,115.57 R11.2 | v39.37,148.59 E10.1
E_DP6  (via drill 1.3 pad 1.27)
  DigitalPins_1 1.016: v44.45,146.05 69.22,146.05 69.22,120.65 v67.31,120.65
  Bottom 1.016: R13.1 C7.1 v67.31,120.65 | v44.45,146.05 E11.1
E_DP7  (via drill 1.3 pad 1.27)
  DigitalPins_2 1.016: v44.45,143.51 48.89,143.51 48.89,120.02 59.69,120.02 C8.1
  Bottom 1.016: C8.1 v62.23,115.57 R15.2 | E12.1 v44.45,143.51
E_GND  (via drill 1.3 pad 1.27)
  Ground 1.016: v24.13,148.59 24.13,150.5 arc90 21.59,153.03 10.8,153.03 arc90 v11.43,151.13 | v29.21,148.59 29.21,151.13 v54.61,151.13
  Bottom 1.016: v11.43,151.13 11.43,148.6 ENC1.1 11.47,146.05 13.97,146.05 ENC1.COM C2.2 C1.2 C5.2 C6.2 ENC3.COM 13.97,92.71 16.51,92.71 16.51,90.79 ENC3.1 | ENC4.1 59.69,90.79 59.69,92.71 57.15,92.71 ENC4.COM C8.2 C7.2 C3.2 C4.2 ENC2.COM 57.15,146.05 54.61,146.05 54.65,146.09 ENC2.1 54.61,148.6 v54.61,151.13 | v24.13,148.59 EGND.1 v29.21,148.59
GND  (via drill 1.3 pad 1.27)
  Ground 0.61: v16.51,11.43 8.89,11.43 6.35,13.97 v6.35,41.91
  Bottom 0.61: JGND.1 16.51,69.85 7.62,69.85 6.35,68.58 TRRS1.1 TRRS2.1 TRRS3.1 TRRS4.1 v6.35,41.91 | U$1.GND v16.51,11.43
N$1
  Bottom 1.016: R6.2 arc90 54.65,128.31 | ENC2.A 54.65,128.27 R6.2 | R5.2 R6.2
N$2
  Bottom 1.016: ENC1.B 16.51,134.1 R3.1 R4.2
N$3
  Bottom 1.016: ENC2.B 59.69,134.1 R7.1 R8.2
N$4
  Bottom 1.016: ENC3.A 16.47,110.49 R9.2 R10.2
N$5
  Bottom 1.016: ENC3.B 11.47,107.95 R11.1 R12.2
N$6
  Bottom 1.016: ENC4.A 59.65,110.49 R13.2 R14.2
N$7
  Bottom 1.016: ENC4.B 54.65,107.95 R15.1 R16.2
N$9
  Bottom 1.016: ENC1.A 11.43,134.1 R2.2 R1.2
SCL  (via drill 1.3 pad 1.27)
  AnalogPins 0.61: U$1.A5 22.86,10.16 21.59,10.16 21.59,4.45 11.43,4.45 v11.43,41.91
  Bottom 0.61: TRRS1.3 TRRS2.3 TRRS3.3 TRRS4.3 v11.43,41.91
SDA  (via drill 1.3 pad 1.27)
  SDA_cable 0.61: U$1.A4 22.86,38.1 v16.51,44.45
  Bottom 0.61: TRRS1.4 TRRS2.4 TRRS3.4 TRRS4.4 v16.51,44.45

### Text on the board
tNames: M-Controller REV-B